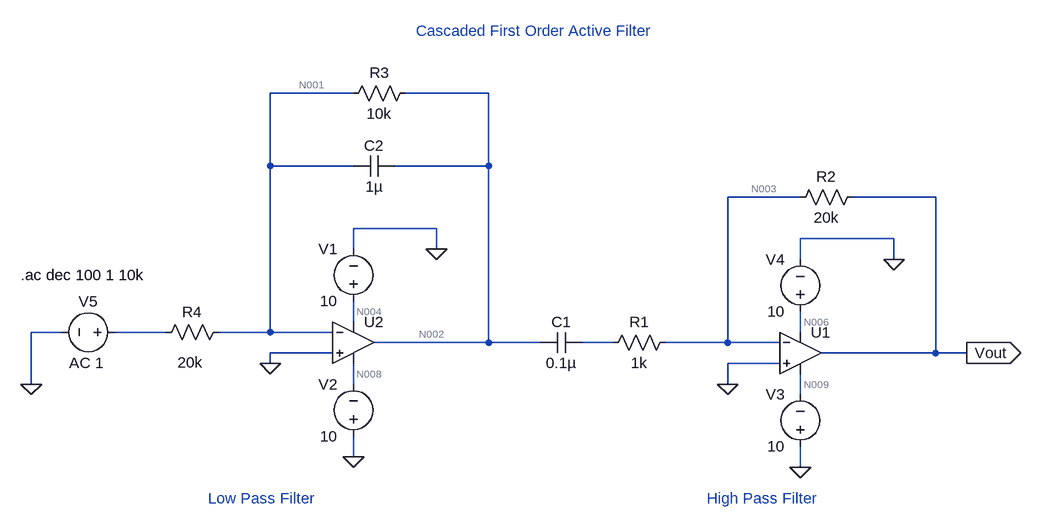
[diagram p0: schematic Cascaded First Order Active Filter.asc]
Cascaded First Order Active Filter.asc, the LTspice schematic file:
Version 4
SHEET 1 1040 680
WIRE -16 -672 -144 -672
WIRE 192 -672 64 -672
WIRE -144 -560 -144 -672
WIRE -16 -560 -144 -560
WIRE 192 -560 192 -672
WIRE 192 -560 48 -560
WIRE 672 -512 560 -512
WIRE 880 -512 752 -512
WIRE 112 -464 -16 -464
WIRE 816 -448 672 -448
WIRE -16 -432 -16 -464
WIRE 112 -432 112 -464
WIRE 672 -416 672 -448
WIRE 816 -416 816 -448
WIRE -16 -320 -16 -352
WIRE -464 -304 -512 -304
WIRE -304 -304 -384 -304
WIRE -144 -304 -144 -560
WIRE -144 -304 -224 -304
WIRE -48 -304 -144 -304
WIRE 672 -304 672 -336
WIRE 192 -288 192 -560
WIRE 192 -288 16 -288
WIRE 272 -288 192 -288
WIRE 384 -288 336 -288
WIRE 560 -288 560 -512
WIRE 560 -288 464 -288
WIRE 640 -288 560 -288
WIRE -48 -272 -144 -272
WIRE 880 -272 880 -512
WIRE 880 -272 704 -272
WIRE 928 -272 880 -272
WIRE -144 -256 -144 -272
WIRE 640 -256 560 -256
WIRE -512 -224 -512 -304
WIRE -16 -224 -16 -256
WIRE 560 -224 560 -256
WIRE 672 -208 672 -240
WIRE -16 -112 -16 -144
WIRE 672 -96 672 -128
FLAG -16 -112 0
FLAG 672 -96 0
FLAG 560 -224 0
FLAG -144 -256 0
FLAG 112 -432 0
FLAG 816 -416 0
FLAG -512 -224 0
FLAG 928 -272 Vout
IOPIN 928 -272 Out
SYMBOL Opamps\\UniversalOpamp2 672 -272 R0
SYMATTR InstName U1
SYMBOL Opamps\\UniversalOpamp2 -16 -288 R0
SYMATTR InstName U2
SYMBOL cap 336 -304 R90
WINDOW 0 0 32 VBottom 2
WINDOW 3 32 32 VTop 2
SYMATTR InstName C1
SYMATTR Value 0.1µ
SYMBOL cap 48 -576 R90
WINDOW 0 0 32 VBottom 2
WINDOW 3 32 32 VTop 2
SYMATTR InstName C2
SYMATTR Value 1µ
SYMBOL voltage -16 -336 R180
WINDOW 0 24 96 Left 2
WINDOW 3 24 16 Left 2
WINDOW 123 0 0 Left 0
WINDOW 39 0 0 Left 0
SYMATTR InstName V1
SYMATTR Value 10
SYMBOL voltage -16 -128 R180
WINDOW 0 24 96 Left 2
WINDOW 3 24 16 Left 2
WINDOW 123 0 0 Left 0
WINDOW 39 0 0 Left 0
SYMATTR InstName V2
SYMATTR Value 10
SYMBOL voltage 672 -112 R180
WINDOW 0 24 96 Left 2
WINDOW 3 24 16 Left 2
WINDOW 123 0 0 Left 0
WINDOW 39 0 0 Left 0
SYMATTR InstName V3
SYMATTR Value 10
SYMBOL voltage 672 -320 R180
WINDOW 0 24 96 Left 2
WINDOW 3 24 16 Left 2
WINDOW 123 0 0 Left 0
WINDOW 39 0 0 Left 0
SYMATTR InstName V4
SYMATTR Value 10
SYMBOL res 480 -304 R90
WINDOW 0 0 56 VBottom 2
WINDOW 3 32 56 VTop 2
SYMATTR InstName R1
SYMATTR Value 1k
SYMBOL res 768 -528 R90
WINDOW 0 0 56 VBottom 2
WINDOW 3 32 56 VTop 2
SYMATTR InstName R2
SYMATTR Value 20k
SYMBOL res 80 -688 R90
WINDOW 0 0 56 VBottom 2
WINDOW 3 32 56 VTop 2
SYMATTR InstName R3
SYMATTR Value 10k
SYMBOL res -208 -320 R90
WINDOW 0 0 56 VBottom 2
WINDOW 3 47 59 VTop 2
SYMATTR InstName R4
SYMATTR Value 20k
SYMBOL voltage -368 -304 R90
WINDOW 0 -32 56 VBottom 2
WINDOW 3 32 56 VTop 2
WINDOW 123 63 59 VBottom 2
WINDOW 39 0 0 Left 0
SYMATTR InstName V5
SYMATTR Value ""
SYMATTR Value2 AC 1
TEXT 80 -768 Left 2 ;Cascaded First Order Active Filter
TEXT -528 -392 Left 2 !.ac dec 100 1 10k
TEXT -240 -48 Left 2 ;Low Pass Filter
TEXT 528 -48 Left 2 ;High Pass Filter

The netlist it stands for:
* Cascaded First Order Active Filter.asc
XU1 0 N003 N006 N009 Vout level.2 Avol=1Meg GBW=10Meg Slew=10Meg ilimit=25m rail=0 Vos=0 phimargin=45 en=0 enk=0 in=0 ink=0 Rin=500Meg  ; pins IN+ IN- V+ V- OUT
XU2 0 N001 N004 N008 N002 level.2 Avol=1Meg GBW=10Meg Slew=10Meg ilimit=25m rail=0 Vos=0 phimargin=45 en=0 enk=0 in=0 ink=0 Rin=500Meg  ; pins IN+ IN- V+ V- OUT
C1 N007 N002 0.1µ
C2 N002 N001 1µ
V1 N004 0 10
V2 0 N008 10
V3 0 N009 10
V4 N006 0 10
R1 N003 N007 1k
R2 Vout N003 20k
R3 N002 N001 10k
R4 N001 N005 20k
V5 N005 0 AC 1
* Cascaded First Order Active Filter
.ac dec 100 1 10k
* Low Pass Filter
* High Pass Filter
.lib UniversalOpamps2.sub
.backanno
.end

* Results of the author's LTspice run, read from the files saved beside the schematic
* Operating Point, zero values left out:
*   V(n006) = 10 V
*   V(n009) = -10 V
*   V(n004) = 10 V
*   V(n008) = -10 V
*   I(V4) = -999.5 µA
*   I(V3) = -999.5 µA
*   I(V2) = -999.5 µA
*   I(V1) = -999.5 µA
*   Ix(u1:3) = 999.5 µA
*   Ix(u1:4) = -999.5 µA
*   Ix(u2:3) = 999.5 µA
*   Ix(u2:4) = -999.5 µA
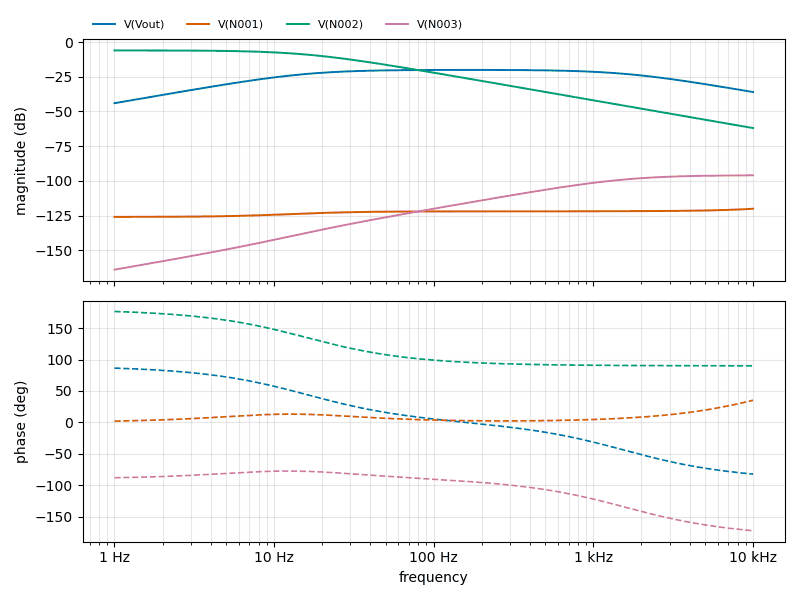
[diagram p1: AC Analysis of Cascaded First Order Active Filter.asc, plotted from the saved traces]
* AC Analysis, 1 run:
*   V(Vout): -44.05 dB at 1 Hz, -36.04 dB at 10 kHz, peak -20.09 dB at 158.5 Hz, 3 dB below the peak at 15.61 Hz and 1.628 kHz
*   V(N001): -125.96 dB at 1 Hz, -120.10 dB at 10 kHz, peak -120.10 dB at 10 kHz, 3 dB below the peak at 20.08 Hz
*   V(N002): -6.04 dB at 1 Hz, -61.98 dB at 10 kHz, peak -6.04 dB at 1 Hz, 3 dB below the peak at 15.98 Hz
*   V(N003): -163.98 dB at 1 Hz, -96.02 dB at 10 kHz, peak -96.02 dB at 10 kHz, 3 dB below the peak at 1.559 kHz